# EAGLE schematic P2H-002 (EAGLE 7.1.0)
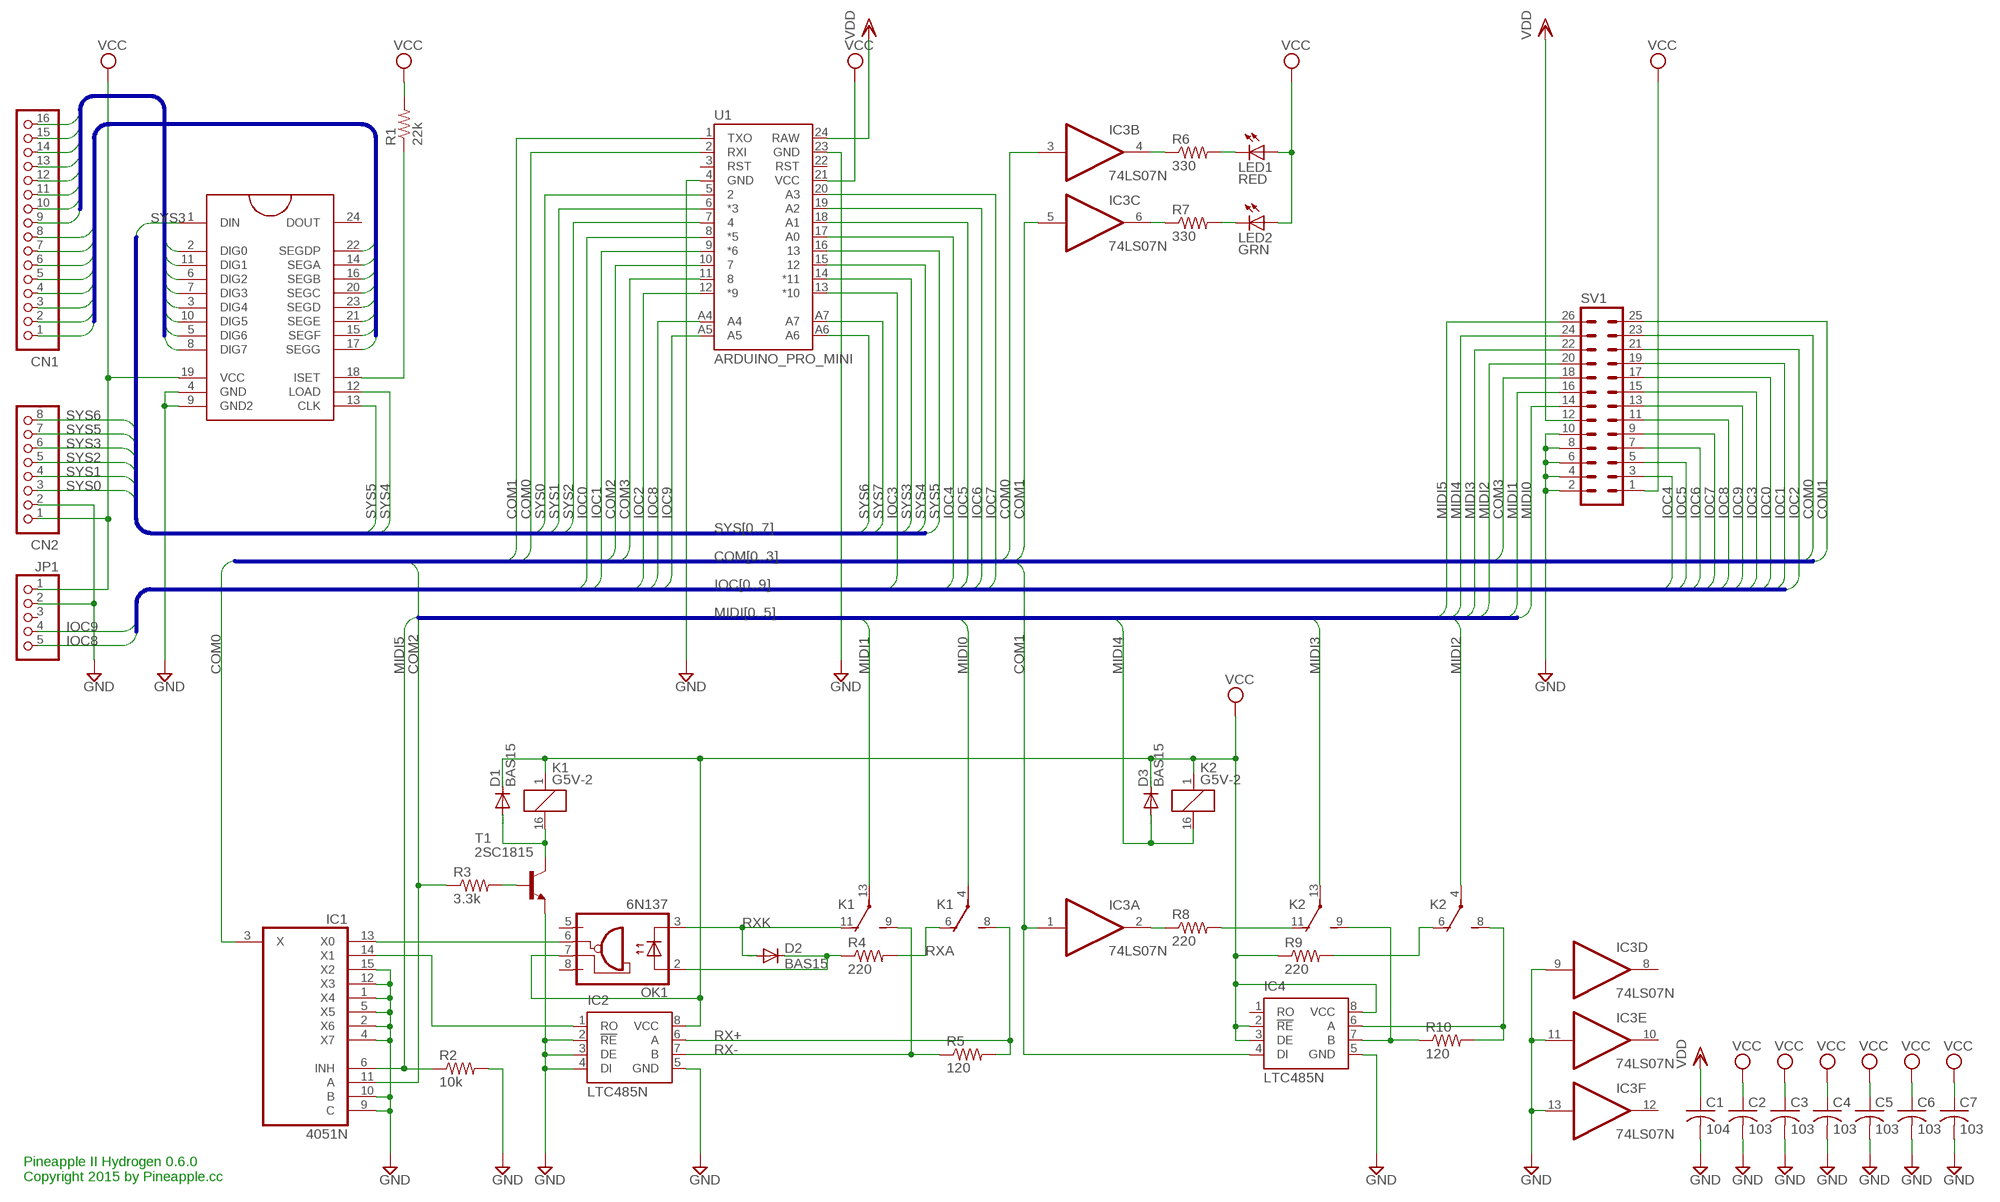
[diagram p0: schematic, sheet 1]

## Parts
C1  104  C-US025-025X050  [C025-025X050]
C2  103  C-US025-025X050  [C025-025X050]
C3  103  C-US025-025X050  [C025-025X050]
C4  103  C-US025-025X050  [C025-025X050]
C5  103  C-US025-025X050  [C025-025X050]
C6  103  C-US025-025X050  [C025-025X050]
C7  103  C-US025-025X050  [C025-025X050]
CN1  S16B-PH-K-S  [S16B-PH-K-S]
CN2  S8B-PH-K-S  [S8B-PH-K-S]
D1  BAS15  [DO34-7]
D2  BAS15  [DO34-7]
D3  BAS15  [DO34-7]
IC1  4051N  [DIL16]
IC2  LTC485N  [DIL08]
IC3  74LS07N  [DIL14]
IC4  LTC485N  [DIL08]
JP1  PINHD-1X5  [1X05]
K1  G5V-2  [G5V-2]
K2  G5V-2  [G5V-2]
LED1  RED  LED3MM  [LED3MM]
LED2  GRN  LED3MM  [LED3MM]
OK1  6N137  [DIL08]
R1  22k  R-US_0204/5  [0204/5]
R2  10k  R-US_0204/5  [0204/5]
R3  3.3k  R-US_0204/5  [0204/5]
R4  220  R-US_0204/5  [0204/5]
R5  120  R-US_0204/5  [0204/5]
R6  330  R-US_0204/5  [0204/5]
R7  330  R-US_0204/5  [0204/5]
R8  220  R-US_0204/5  [0204/5]
R9  220  R-US_0204/5  [0204/5]
R10  120  R-US_0204/5  [0204/5]
SV1  ML26L  [ML26L]
T1  2SC1815  [TO92-ECB]
U1  ARDUINO_PRO_MINI  [ARDUINO_PRO_MINI]
U2  MAX7219DIP  [DIL24]

## Nets
COM0: IC1.3(X) IC3.3(B:I) SV1.23 U1.2(RXI)
COM1: IC3.1(A:I) IC3.5(C:I) IC4.4(DI) SV1.25 U1.1(TXO)
COM2: IC1.11(A) R3.1 U1.10
COM3: SV1.18 U1.11
GND: C1.2 C2.2 C3.2 C4.2 C5.2 C6.2 C7.2 CN2.2 IC1.1(X4) IC1.2(X6) IC1.4(X7) IC1.5(X5) IC1.9(C) IC1.10(B) IC1.12(X3) IC1.15(X2) IC2.2(!RE) IC2.3(DE) IC2.4(DI) IC2.5(GND) IC3.9(D:I) IC3.11(E:I) IC3.13(F:I) IC4.5(GND) JP1.2 R2.2 SV1.2 SV1.4 SV1.6 SV1.8 SV1.10 T1.E U1.4(GND) U1.23(GND) U2.4(GND) U2.9(GND2)
HSRX: IC1.14(X1) IC2.1(RO)
IOC0: SV1.17 U1.8(*5)
IOC1: SV1.19 U1.9(*6)
IOC2: SV1.21 U1.12(*9)
IOC3: SV1.15 U1.13(*10)
IOC4: SV1.3 U1.17(A0)
IOC5: SV1.5 U1.18(A1)
IOC6: SV1.7 U1.19(A2)
IOC7: SV1.9 U1.20(A3)
IOC8: JP1.5 SV1.11 U1.A4
IOC9: JP1.4 SV1.13 U1.A5
LD0: CN1.9 U2.2(DIG0)
LD1: CN1.10 U2.11(DIG1)
LD2: CN1.11 U2.6(DIG2)
LD3: CN1.12 U2.7(DIG3)
LD4: CN1.13 U2.3(DIG4)
LD5: CN1.14 U2.10(DIG5)
LD6: CN1.15 U2.5(DIG6)
LD7: CN1.16 U2.8(DIG7)
LS0: CN1.1 U2.22(SEGDP)
LS1: CN1.2 U2.14(SEGA)
LS2: CN1.3 U2.16(SEGB)
LS3: CN1.4 U2.20(SEGC)
LS4: CN1.5 U2.23(SEGD)
LS5: CN1.6 U2.21(SEGE)
LS6: CN1.7 U2.15(SEGF)
LS7: CN1.8 U2.17(SEGG)
MIDI0: K1.4(1:P) SV1.14
MIDI1: K1.13(2:P) SV1.16
MIDI2: K2.4(1:P) SV1.20
MIDI3: K2.11(2:O) K2.13(2:P) R8.2 SV1.22
MIDI4: D3.A K2.16 SV1.24
MIDI5: IC1.6(INH) R2.1 SV1.26
MIDI7: IC4.7(B) K2.9(2:S) R10.1
MIDIRX: IC1.13(X0) OK1.6(VO)
N$1: R3.2 T1.B
N$2: IC3.2(A:O) R8.1
N$3: IC3.4(B:O) R6.1
N$4: IC3.6(C:O) R7.1
N$5: LED1.K(C) R6.2
N$6: LED2.K(C) R7.2
N$8: IC4.6(A) K2.8(1:S) R10.2
N$9: K2.6(1:O) R9.2
N$11: D1.A K1.16 T1.C
N$13: D2.C OK1.2(A) R4.1
N$21: R1.1 U2.18(ISET)
RX+: IC2.6(A) K1.8(1:S) R5.2
RX-: IC2.7(B) K1.9(2:S) R5.1
RXA: K1.6(1:O) R4.2
RXK: D2.A K1.11(2:O) OK1.3(C)
SYS0: CN2.3 U1.5
SYS1: CN2.4 U1.6(*3)
SYS2: CN2.5 U1.7
SYS3: CN2.6 U1.14(*11) U2.1(DIN)
SYS4: U1.15 U2.12(LOAD)
SYS5: CN2.7 U1.16 U2.13(CLK)
SYS6: CN2.8 U1.A6
SYS7: U1.A7
VCC: C2.1 C3.1 C4.1 C5.1 C6.1 C7.1 CN2.1 D1.C D3.C IC2.8(VCC) IC4.2(!RE) IC4.3(DE) IC4.8(VCC) JP1.1 K1.1 K2.1 LED1.A LED2.A OK1.7(VE) R1.2 R9.1 SV1.1 U1.21(VCC) U2.19(VCC)
VDD: C1.1 U1.24(RAW)
Unconnected: IC3.8(D:O) IC3.10(E:O) IC3.12(F:O) IC4.1(RO) JP1.3 OK1.5(GND) OK1.8(VCC) SV1.12 U1.3(RST) U1.22(RST) U2.24(DOUT)

## Buses
IOC[0..9]
LS[0..7]
LD[0..7]
COM[0..3]
SYS[0..7]
MIDI[0..5]

## Notes on the sheet
- Pineapple II Hydrogen 0.6.0
  Copyright 2015 by Pineapple.cc

## Power pins joined to a net without a drawn wire
GND: IC1.8(GND) IC3.7(P:GND)
VCC: IC1.16(VCC) IC3.14(P:VCC)
VEE: IC1.7(VEE)

## Library data of the parts
C1-C7 = rcl:C-US: CAPACITOR, American symbol
CN1 = jst-ph:S16B-PH-*: Wire-to-Board 2.0mm pitch side mount connector Source: http://www.jst-mfg.com/product/pdf/jpn/PH.pdf http://www.jst-mfg.com/product/detail.php?series=199
CN2 = jst-ph:S8B-PH-*: Wire-to-Board 2.0mm pitch side mount connector Source: http://www.jst-mfg.com/product/pdf/jpn/PH.pdf http://www.jst-mfg.com/product/detail.php?series=199
D1-D3 = diode:BAS15: DIODE high speed
IC1 = 40xx:4051: 8-channel ANALOG MULTIPLEXER
IC2 IC4 = linear-technology:LTC485: Low Power RS485 Interface Transceiver Source: http://www.linear.com/pc/downloadDocument.do?navId=H0,C1,C1007,C1017,P2064,D1718; OC_FARNELL: unknown; OC_NEWARK: unknown
IC3 = 74xx-us:74*07: Hex BUFFER, open collector high-voltage output
JP1 = pinhead:PINHD-1X5: PIN HEADER
K1 K2 = relay:G5V-2: OMRON PCB Relay Source: http://www.omron.com/ecb/products/pdf/en-g5v2.pdf; MPN: G5V-2 5DC; OC_FARNELL: 9949488; OC_NEWARK: 78K5703
LED1 LED2 = led:LED: LED OSRAM: - CHIPLED LG R971, LG N971, LY N971, LG Q971, LY Q971, LO R971, LY R971 LH N974, LH R974 LS Q976, LO Q976, LY Q976 LO Q996 - Hyper CHIPLED LW Q18S LB Q993, LB Q99A, LB R99A - SideLED LS A670, LO A670, LY A670, LG A670, LP A670 LB A673, LV A673, LT A673, LW A673 LH A674 LY A675 LS A676, LA A676, LO A676, LY A676, LW A676 LS A679, LY A679, LG A679 - Hyper Micro SIDELED® LS Y876, LA Y876, LO Y876, LY Y876 LT Y87S - SmartLED LW L88C, LW L88S LB L89C, LB L89S, LG L890 LS L89K, LO L89K, LY L89K LS L896, LA L896, LO L896, LY L896 - TOPLED LS T670, LO T670, LY T670, LG T670, LP T670 LSG T670, LSP T670, LSY T670, LOP T670, LYG T670 LG T671, LOG T671, LSG T671 LB T673, LV T673, LT T673, LW T673 LH T674 LS T676, LA T676, LO T676, LY T676, LB T676, LH T676, LSB T676, LW T676 LB T67C, LV T67C, LT T67C, LS T67K, LO T67K, LY T67K, LW E67C LS E67B, LA E67B, LO E67B, LY E67B, LB E67C, LV E67C, LT E67C LW T67C LS T679, LY T679, LG T679 LS T770, LO T770, LY T770, LG T770, LP T770 LB T773, LV T773, LT T773, LW T773 LH T774 LS E675, LA E675, LY E675, LS T675 LS T776, LA T776, LO T776, LY T776, LB T776 LHGB T686 LT T68C, LB T68C - Hyper Mini TOPLED® LB M676 - Mini TOPLED Santana® LG M470 LS M47K, LO M47K, LY M47K Source: http://www.osram.convergy.de LUXEON: - LUMILED® LXK2-PW12-R00, LXK2-PW12-S00, LXK2-PW14-U00, LXK2-PW14-V00 LXK2-PM12-R00, LXK2-PM12-S00, LXK2-PM14-U00 LXK2-PE12-Q00, LXK2-PE12-R00, LXK2-PE12-S00, LXK2-PE14-T00, LXK2-PE14-U00 LXK2-PB12-K00, LXK2-PB12-L00, LXK2-PB12-M00, LXK2-PB14-N00, LXK2-PB14-P00, LXK2-PB14-Q00 LXK2-PR12-L00, LXK2-PR12-M00, LXK2-PR14-Q00, LXK2-PR14-R00 LXK2-PD12-Q00, LXK2-PD12-R00, LXK2-PD12-S00 LXK2-PH12-R00, LXK2-PH12-S00 LXK2-PL12-P00, LXK2-PL12-Q00, LXK2-PL12-R00 Source: www.luxeon.com KINGBRIGHT: KA-3528ASYC Source: www.kingbright.com
OK1 = optocoupler:6N137: MOTOROLA OPTO COUPLER; MPN: 6N137; OC_FARNELL: 1328376; OC_NEWARK: 52M1895
R1-R10 = resistor:R-US_: RESISTOR, American symbol
SV1 = con-ml:ML26L: HARTING; OC_FARNELL: unknown; OC_NEWARK: unknown
T1 = transistor:2SC1815: NPN EPITAXIAL TRANSISTOR Source: TOSHIBA .. 2SC1815 1.pdf
U1 = SparkFun-Boards:ARDUINO_PRO_MINI
U2 = SparkFun-DigitalIC:MAX7219: 8-digit, 8-segment LED display driver, serial input